# Altium schematic sheet foxbms2-master.SchDoc
size A3; SheetDescription: Top-Level Structure of foxBMS 2 BMS-Master; DocumentNumber: 1; SheetNumber: 1; SheetTotal: 45
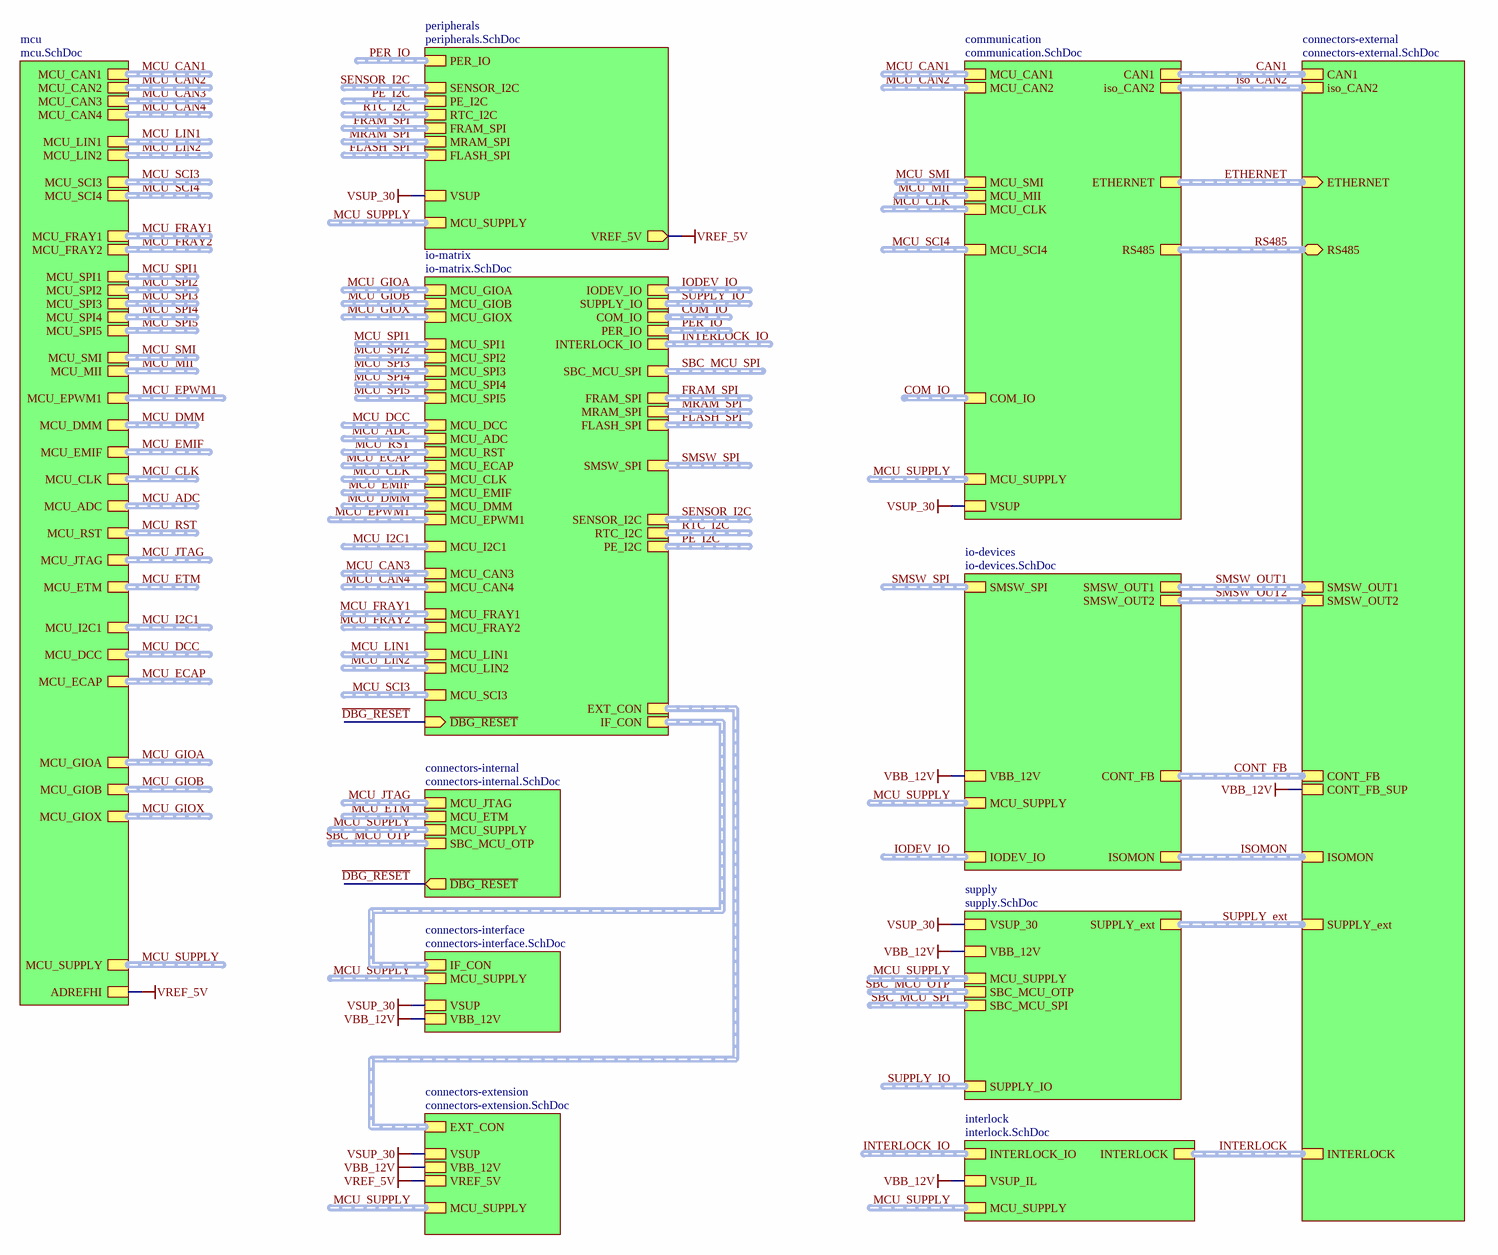
[diagram p0: foxbms2-master.SchDoc]

## Sub-sheets
communication = communication.SchDoc: VSUP, MCU_SUPPLY (harness MCU_SUPPLY), iso_CAN2 (harness CAN), CAN1 (harness CAN), ETHERNET (harness ETHERNET), MCU_MII (harness MCU_MII), MCU_SMI (harness MCU_SMI), MCU_CLK (harness CLOCK), MCU_SCI4 (harness MCU_SCI), MCU_CAN2 (harness MCU_CAN), MCU_CAN1 (harness MCU_CAN), COM_IO (harness COM_IO), RS485 (harness RS485)
connectors-extension = connectors-extension.SchDoc: VBB_12V, VSUP, EXT_CON (harness EXT_CON), MCU_SUPPLY (harness MCU_SUPPLY), VREF_5V
connectors-external = connectors-external.SchDoc: ETHERNET (in, harness ETHERNET), iso_CAN2 (harness CAN), CAN1 (harness CAN), SMSW_OUT1 (harness SMSW_OUT), SMSW_OUT2 (harness SMSW_OUT), SUPPLY_ext (harness SUPPLY_EXT), CONT_FB_SUP, CONT_FB (harness PE_IO), ISOMON (harness ISOMON), INTERLOCK (harness INTERLOCK), RS485 (bidir, harness RS485)
connectors-interface = connectors-interface.SchDoc: IF_CON (harness INTERFACE_CON), VBB_12V, VSUP, MCU_SUPPLY (harness MCU_SUPPLY)
connectors-internal = connectors-internal.SchDoc: MCU_JTAG (harness MCU_JTAG), SBC_MCU_OTP (harness SBC_OTP), MCU_ETM (harness MCU_ETM), MCU_SUPPLY (harness MCU_SUPPLY), ~{DBG_RESET} (out)
interlock = interlock.SchDoc: VSUP_IL, INTERLOCK_IO (harness INTERLOCK_IO), INTERLOCK (harness INTERLOCK), MCU_SUPPLY (harness MCU_SUPPLY)
io-devices = io-devices.SchDoc: CONT_FB (harness PE_IO), SMSW_OUT1 (harness SMSW_OUT), SMSW_OUT2 (harness SMSW_OUT), ISOMON (harness ISOMON), IODEV_IO (harness IODEV_IO), SMSW_SPI (harness SPI), VBB_12V, MCU_SUPPLY (harness MCU_SUPPLY)
io-matrix = io-matrix.SchDoc: IODEV_IO (harness IODEV_IO), COM_IO (harness COM_IO), MCU_GIOB (harness MCU_GIOB), MCU_GIOA (harness MCU_GIOA), MCU_GIOX (harness MCU_GIOX), SBC_MCU_SPI (harness SPI), FRAM_SPI (harness SPI), MCU_SPI1 (harness MCU_SPI1), MCU_SPI2 (harness MCU_SPI2), MCU_SPI4 (harness MCU_SPI4), MRAM_SPI (harness SPI), SENSOR_I2C (harness I2C), MCU_DCC (harness MCU_DCC), MCU_ADC (harness MCU_ADC), MCU_RST (harness MCU_RST), RTC_I2C (harness I2C), FLASH_SPI (harness SPI), MCU_ECAP (harness MCU_ECAP), PE_I2C (harness I2C), MCU_CLK (harness CLOCK), SMSW_SPI (harness SPI), INTERLOCK_IO (harness INTERLOCK_IO), SUPPLY_IO (harness SUPPLY_IO), PER_IO (harness PER_IO), ~{DBG_RESET} (in), MCU_SPI5 (harness MCU_SPI5), EXT_CON (harness EXT_CON), IF_CON (harness INTERFACE_CON), MCU_SPI3 (harness MCU_SPI3), MCU_I2C1 (harness MCU_I2C), MCU_LIN2 (harness MCU_LIN), MCU_FRAY1 (harness MCU_FRAY), MCU_FRAY2 (harness MCU_FRAY), MCU_LIN1 (harness MCU_LIN), MCU_EMIF (harness MCU_EMIF), MCU_EPWM1 (harness MCU_EPWM), MCU_DMM (harness MCU_DMM), MCU_CAN3 (harness MCU_CAN), MCU_CAN4 (harness MCU_CAN), MCU_SCI3 (harness MCU_SCI)
mcu = mcu.SchDoc: ADREFHI, MCU_EPWM1 (harness MCU_EPWM), MCU_LIN2 (harness MCU_LIN), MCU_FRAY2 (harness MCU_FRAY), MCU_CAN4 (harness MCU_CAN), MCU_CAN3 (harness MCU_CAN), MCU_SPI2 (harness MCU_SPI2), MCU_SCI3 (harness MCU_SCI), MCU_CAN1 (harness MCU_CAN), MCU_DMM (harness MCU_DMM), MCU_EMIF (harness MCU_EMIF), MCU_CLK (harness CLOCK), MCU_RST (harness MCU_RST), MCU_JTAG (harness MCU_JTAG), MCU_ETM (harness MCU_ETM), MCU_CAN2 (harness MCU_CAN), MCU_SPI5 (harness MCU_SPI5), MCU_SPI4 (harness MCU_SPI4), MCU_I2C1 (harness MCU_I2C), MCU_SMI (harness MCU_SMI), MCU_SPI3 (harness MCU_SPI3), MCU_MII (harness MCU_MII), MCU_SPI1 (harness MCU_SPI1), MCU_LIN1 (harness MCU_LIN), MCU_FRAY1 (harness MCU_FRAY), MCU_SCI4 (harness MCU_SCI), MCU_SUPPLY (harness MCU_SUPPLY), MCU_GIOB (harness MCU_GIOB), MCU_GIOA (harness MCU_GIOA), MCU_DCC (harness MCU_DCC), MCU_ECAP (harness MCU_ECAP), MCU_ADC (harness MCU_ADC), MCU_GIOX (harness MCU_GIOX)
peripherals = peripherals.SchDoc: MCU_SUPPLY (harness MCU_SUPPLY), VSUP, SENSOR_I2C (harness I2C), PE_I2C (harness I2C), RTC_I2C (harness I2C), MRAM_SPI (harness SPI), FLASH_SPI (harness SPI), FRAM_SPI (harness SPI), PER_IO (harness PER_IO), VREF_5V (out)
supply = supply.SchDoc: SBC_MCU_OTP (harness SBC_OTP), MCU_SUPPLY (harness MCU_SUPPLY), SUPPLY_ext (harness SUPPLY_EXT), VSUP_30, VBB_12V, SUPPLY_IO (harness SUPPLY_IO), SBC_MCU_SPI (harness SPI)

## Nets
VBB_12V: sheet connectors-external/CONT_FB_SUP, sheet io-devices/VBB_12V, sheet supply/VBB_12V, sheet interlock/VSUP_IL, sheet connectors-interface/VBB_12V, sheet connectors-extension/VBB_12V
VREF_5V: sheet mcu/ADREFHI, sheet peripherals/VREF_5V, sheet connectors-extension/VREF_5V
VSUP_30: sheet communication/VSUP, sheet peripherals/VSUP, sheet supply/VSUP_30, sheet connectors-interface/VSUP, sheet connectors-extension/VSUP
~{DBG_RESET}: sheet connectors-internal/~{DBG_RESET}, sheet io-matrix/~{DBG_RESET}

## Buses and harness runs
harness CAN1 = sheet communication/CAN1 = sheet connectors-external/CAN1
harness COM_IO = sheet communication/COM_IO
harness COM_IO = sheet io-matrix/COM_IO
harness CONT_FB = sheet connectors-external/CONT_FB = sheet io-devices/CONT_FB
harness ETHERNET = sheet communication/ETHERNET = sheet connectors-external/ETHERNET
harness FLASH_SPI = sheet io-matrix/FLASH_SPI
harness FLASH_SPI = sheet peripherals/FLASH_SPI
harness FRAM_SPI = sheet io-matrix/FRAM_SPI
harness FRAM_SPI = sheet peripherals/FRAM_SPI
harness INTERLOCK = sheet connectors-external/INTERLOCK = sheet interlock/INTERLOCK
harness INTERLOCK_IO = sheet interlock/INTERLOCK_IO
harness INTERLOCK_IO = sheet io-matrix/INTERLOCK_IO
harness IODEV_IO = sheet io-devices/IODEV_IO
harness IODEV_IO = sheet io-matrix/IODEV_IO
harness iso_CAN2 = sheet communication/iso_CAN2 = sheet connectors-external/iso_CAN2
harness ISOMON = sheet connectors-external/ISOMON = sheet io-devices/ISOMON
harness MCU_ADC = sheet io-matrix/MCU_ADC
harness MCU_ADC = sheet mcu/MCU_ADC
harness MCU_CAN1 = sheet communication/MCU_CAN1
harness MCU_CAN1 = sheet mcu/MCU_CAN1
harness MCU_CAN2 = sheet communication/MCU_CAN2
harness MCU_CAN2 = sheet mcu/MCU_CAN2
harness MCU_CAN3 = sheet io-matrix/MCU_CAN3
harness MCU_CAN3 = sheet mcu/MCU_CAN3
harness MCU_CAN4 = sheet io-matrix/MCU_CAN4
harness MCU_CAN4 = sheet mcu/MCU_CAN4
harness MCU_CLK = sheet communication/MCU_CLK
harness MCU_CLK = sheet io-matrix/MCU_CLK
harness MCU_CLK = sheet mcu/MCU_CLK
harness MCU_DCC = sheet io-matrix/MCU_DCC
harness MCU_DCC = sheet mcu/MCU_DCC
harness MCU_DMM = sheet io-matrix/MCU_DMM
harness MCU_DMM = sheet mcu/MCU_DMM
harness MCU_ECAP = sheet io-matrix/MCU_ECAP
harness MCU_ECAP = sheet mcu/MCU_ECAP
harness MCU_EMIF = sheet io-matrix/MCU_EMIF
harness MCU_EMIF = sheet mcu/MCU_EMIF
harness MCU_EPWM1 = sheet io-matrix/MCU_EPWM1
harness MCU_EPWM1 = sheet mcu/MCU_EPWM1
harness MCU_ETM = sheet connectors-internal/MCU_ETM
harness MCU_ETM = sheet mcu/MCU_ETM
harness MCU_FRAY1 = sheet io-matrix/MCU_FRAY1
harness MCU_FRAY1 = sheet mcu/MCU_FRAY1
harness MCU_FRAY2 = sheet io-matrix/MCU_FRAY2
harness MCU_FRAY2 = sheet mcu/MCU_FRAY2
harness MCU_GIOA = sheet io-matrix/MCU_GIOA
harness MCU_GIOA = sheet mcu/MCU_GIOA
harness MCU_GIOB = sheet io-matrix/MCU_GIOB
harness MCU_GIOB = sheet mcu/MCU_GIOB
harness MCU_GIOX = sheet io-matrix/MCU_GIOX
harness MCU_GIOX = sheet mcu/MCU_GIOX
harness MCU_I2C1 = sheet io-matrix/MCU_I2C1
harness MCU_I2C1 = sheet mcu/MCU_I2C1
harness MCU_JTAG = sheet connectors-internal/MCU_JTAG
harness MCU_JTAG = sheet mcu/MCU_JTAG
harness MCU_LIN1 = sheet io-matrix/MCU_LIN1
harness MCU_LIN1 = sheet mcu/MCU_LIN1
harness MCU_LIN2 = sheet io-matrix/MCU_LIN2
harness MCU_LIN2 = sheet mcu/MCU_LIN2
harness MCU_MII = sheet communication/MCU_MII
harness MCU_MII = sheet mcu/MCU_MII
harness MCU_RST = sheet io-matrix/MCU_RST
harness MCU_RST = sheet mcu/MCU_RST
harness MCU_SCI3 = sheet io-matrix/MCU_SCI3
harness MCU_SCI3 = sheet mcu/MCU_SCI3
harness MCU_SCI4 = sheet communication/MCU_SCI4
harness MCU_SCI4 = sheet mcu/MCU_SCI4
harness MCU_SMI = sheet communication/MCU_SMI
harness MCU_SMI = sheet mcu/MCU_SMI
harness MCU_SPI1 = sheet io-matrix/MCU_SPI1
harness MCU_SPI1 = sheet mcu/MCU_SPI1
harness MCU_SPI2 = sheet io-matrix/MCU_SPI2
harness MCU_SPI2 = sheet mcu/MCU_SPI2
harness MCU_SPI3 = sheet io-matrix/MCU_SPI3
harness MCU_SPI3 = sheet mcu/MCU_SPI3
harness MCU_SPI4 = sheet io-matrix/MCU_SPI4
harness MCU_SPI4 = sheet mcu/MCU_SPI4
harness MCU_SPI5 = sheet io-matrix/MCU_SPI5
harness MCU_SPI5 = sheet mcu/MCU_SPI5
harness MCU_SUPPLY = sheet communication/MCU_SUPPLY
harness MCU_SUPPLY = sheet connectors-extension/MCU_SUPPLY
harness MCU_SUPPLY = sheet connectors-interface/MCU_SUPPLY
harness MCU_SUPPLY = sheet connectors-internal/MCU_SUPPLY
harness MCU_SUPPLY = sheet interlock/MCU_SUPPLY
harness MCU_SUPPLY = sheet io-devices/MCU_SUPPLY
harness MCU_SUPPLY = sheet mcu/MCU_SUPPLY
harness MCU_SUPPLY = sheet peripherals/MCU_SUPPLY
harness MCU_SUPPLY = sheet supply/MCU_SUPPLY
harness MRAM_SPI = sheet io-matrix/MRAM_SPI
harness MRAM_SPI = sheet peripherals/MRAM_SPI
harness PE_I2C = sheet io-matrix/PE_I2C
harness PE_I2C = sheet peripherals/PE_I2C
harness PER_IO = sheet io-matrix/PER_IO
harness PER_IO = sheet peripherals/PER_IO
harness RS485 = sheet communication/RS485 = sheet connectors-external/RS485
harness RTC_I2C = sheet io-matrix/RTC_I2C
harness RTC_I2C = sheet peripherals/RTC_I2C
harness SBC_MCU_OTP = sheet connectors-internal/SBC_MCU_OTP
harness SBC_MCU_OTP = sheet supply/SBC_MCU_OTP
harness SBC_MCU_SPI = sheet io-matrix/SBC_MCU_SPI
harness SBC_MCU_SPI = sheet supply/SBC_MCU_SPI
harness SENSOR_I2C = sheet io-matrix/SENSOR_I2C
harness SENSOR_I2C = sheet peripherals/SENSOR_I2C
harness sheet connectors-extension/EXT_CON = sheet io-matrix/EXT_CON
harness sheet connectors-interface/IF_CON = sheet io-matrix/IF_CON
harness SMSW_OUT1 = sheet connectors-external/SMSW_OUT1 = sheet io-devices/SMSW_OUT1
harness SMSW_OUT2 = sheet connectors-external/SMSW_OUT2 = sheet io-devices/SMSW_OUT2
harness SMSW_SPI = sheet io-devices/SMSW_SPI
harness SMSW_SPI = sheet io-matrix/SMSW_SPI
harness SUPPLY_ext = sheet connectors-external/SUPPLY_ext = sheet supply/SUPPLY_ext
harness SUPPLY_IO = sheet io-matrix/SUPPLY_IO
harness SUPPLY_IO = sheet supply/SUPPLY_IO

## Notes on the sheet
- Fraunhofer IISB
- Schottkystr. 10
- developed by:
- 91058 Erlangen
- Germany
- Author
- Project
- License
- Description
- File
- Version
- Release Date
- Sheet
- foxbms.org <https://foxbms.org>
- www.iisb.fraunhofer.de <https://www.iisb.fraunhofer.de/>
- foxBMS Team
- /